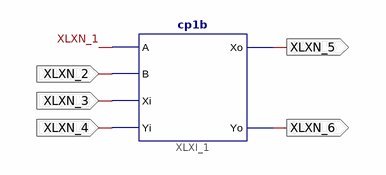
[diagram p0: schematic sheet 1]
// Xilinx ISE schematic ff.sch (xc9500) as structural Verilog: 1 symbols, 5 ports
module ff (
  input  XLXN_2,
  input  XLXN_3,
  input  XLXN_4,
  output XLXN_5,
  output XLXN_6
);

  wire XLXN_1;

  cp1b XLXI_1 (.A(XLXN_1), .B(XLXN_2), .Xi(XLXN_3), .Yi(XLXN_4), .Xo(XLXN_5), .Yo(XLXN_6));
endmodule
